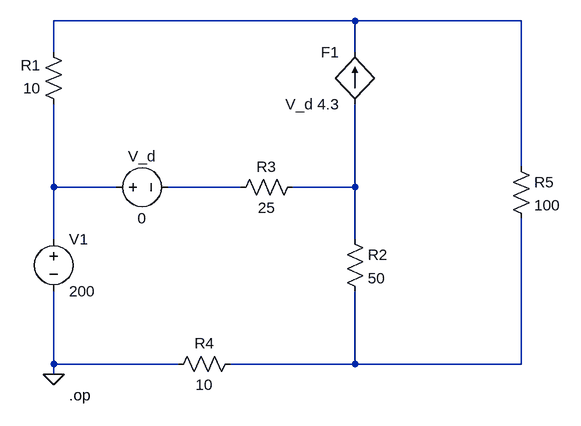
[diagram p0: schematic CH03-KP1-12.asc]
CH03-KP1-12.asc, the LTspice schematic file:
Version 4
SHEET 1 880 688
WIRE 352 96 -112 96
WIRE 608 96 352 96
WIRE -112 144 -112 96
WIRE 352 144 352 96
WIRE 608 320 608 96
WIRE -112 352 -112 224
WIRE -16 352 -112 352
WIRE 176 352 64 352
WIRE 352 352 352 224
WIRE 352 352 256 352
WIRE -112 432 -112 352
WIRE 352 432 352 352
WIRE -112 624 -112 512
WIRE 80 624 -112 624
WIRE 352 624 352 512
WIRE 352 624 160 624
WIRE 608 624 608 400
WIRE 608 624 352 624
WIRE -112 640 -112 624
FLAG -112 640 0
SYMBOL voltage -112 416 R0
SYMATTR InstName V1
SYMATTR Value 200
SYMBOL voltage -32 352 R270
WINDOW 0 32 56 VTop 2
WINDOW 3 -32 56 VBottom 2
SYMATTR InstName V_d
SYMATTR Value 0
SYMBOL res -96 240 R180
WINDOW 0 36 76 Left 2
WINDOW 3 36 40 Left 2
SYMATTR InstName R1
SYMATTR Value 10
SYMBOL res 336 416 R0
SYMATTR InstName R2
SYMATTR Value 50
SYMBOL res 160 368 R270
WINDOW 0 32 56 VTop 2
WINDOW 3 0 56 VBottom 2
SYMATTR InstName R3
SYMATTR Value 25
SYMBOL res 176 608 R90
WINDOW 0 0 56 VBottom 2
WINDOW 3 32 56 VTop 2
SYMATTR InstName R4
SYMATTR Value 10
SYMBOL res 592 304 R0
SYMATTR InstName R5
SYMATTR Value 100
SYMBOL f 352 224 R180
WINDOW 0 24 80 Left 2
WINDOW 3 24 0 Left 2
SYMATTR InstName F1
SYMATTR Value V_d 4.3
TEXT -88 672 Left 2 !.op

The netlist it stands for:
* CH03-KP1-12.asc
V1 N002 0 200
V_d N002 N003 0
R1 N002 N001 10
R2 N004 N005 50
R3 N003 N004 25
R4 N005 0 10
R5 N001 N005 100
F1 N004 N001 V_d 4.3
.op
.backanno
.end